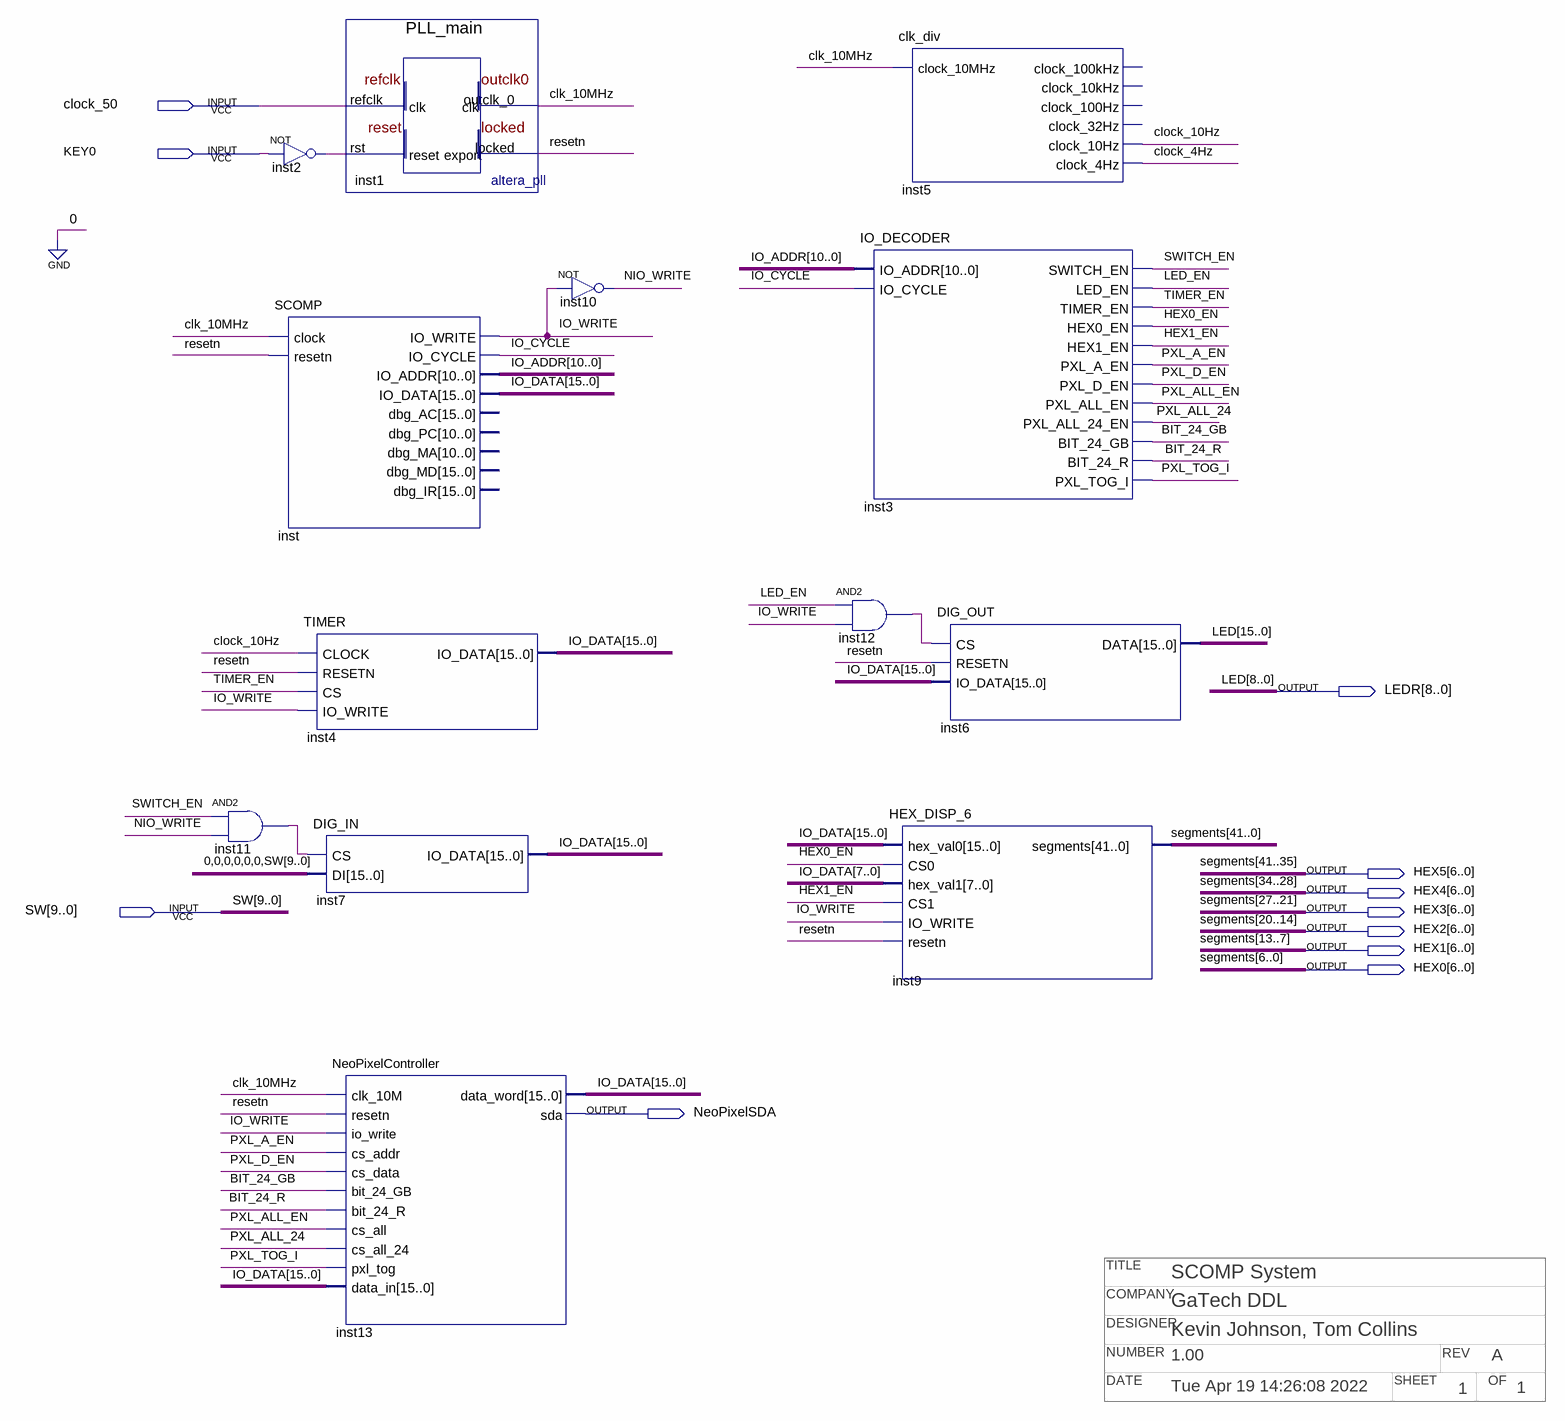
[diagram p0: schematic sheet]
// Quartus schematic SCOMP_System.bdf as structural Verilog: 13 symbols, 11 pins
// Title block: COMPANY: GaTech DDL; DATE: Tue Apr 19 14:26:08 2022; DESIGNER: Kevin Johnson, Tom Collins; NUMBER: 1.00; OF: 1; REV: A; SHEET: 1; TITLE: SCOMP System
module SCOMP_System (
  input  clock_50,
  input  KEY0,
  input  [9:0] SW,
  output [8:0] LEDR,
  output [6:0] HEX5,
  output [6:0] HEX4,
  output [6:0] HEX3,
  output [6:0] HEX2,
  output [6:0] HEX1,
  output [6:0] HEX0,
  output NeoPixelSDA
);

  wire BIT_24_GB, BIT_24_R, clk_10MHz, clock_4Hz, clock_10Hz, HEX0_EN, HEX1_EN, inst2_out, inst11_out,
       inst12_out, IO_CYCLE, IO_WRITE, LED_EN, NIO_WRITE, PXL_A_EN, PXL_ALL_24, PXL_ALL_EN, PXL_D_EN,
       PXL_TOG_I, resetn, SWITCH_EN, TIMER_EN;
  wire [10:0] IO_ADDR;
  wire [15:0] IO_DATA;
  wire [15:9] LED;

  and inst11 (inst11_out, SWITCH_EN, NIO_WRITE);
  not inst2 (inst2_out, KEY0);
  SCOMP inst (
    .clock(clk_10MHz), .resetn(resetn), .IO_WRITE(IO_WRITE), .IO_CYCLE(IO_CYCLE), .IO_ADDR(IO_ADDR),
    .IO_DATA(IO_DATA));  // open: dbg_AC, dbg_PC, dbg_MA, dbg_MD, dbg_IR
  TIMER inst4 (.CLOCK(clock_10Hz), .RESETN(resetn), .CS(TIMER_EN), .IO_WRITE(IO_WRITE), .IO_DATA(IO_DATA));
  DIG_IN inst7 (.CS(inst11_out), .DI({{6{1'b0}}, SW}), .IO_DATA(IO_DATA));
  PLL_main inst1 (.refclk(clock_50), .rst(inst2_out), .outclk_0(clk_10MHz), .locked(resetn));
  NeoPixelController inst13 (
    .clk_10M(clk_10MHz), .resetn(resetn), .io_write(IO_WRITE), .cs_addr(PXL_A_EN), .cs_data(PXL_D_EN),
    .bit_24_GB(BIT_24_GB), .bit_24_R(BIT_24_R), .cs_all(PXL_ALL_EN), .cs_all_24(PXL_ALL_24),
    .pxl_tog(PXL_TOG_I), .data_in(IO_DATA), .data_word(IO_DATA), .sda(NeoPixelSDA));
  not inst10 (NIO_WRITE, IO_WRITE);
  and inst12 (inst12_out, LED_EN, IO_WRITE);
  clk_div inst5 (
    .clock_10MHz(clk_10MHz), .clock_10Hz(clock_10Hz), .clock_4Hz(clock_4Hz));  // open: clock_100kHz, clock_10kHz, clock_100Hz, clock_32Hz
  IO_DECODER inst3 (
    .IO_ADDR(IO_ADDR), .IO_CYCLE(IO_CYCLE), .SWITCH_EN(SWITCH_EN), .LED_EN(LED_EN), .TIMER_EN(TIMER_EN),
    .HEX0_EN(HEX0_EN), .HEX1_EN(HEX1_EN), .PXL_A_EN(PXL_A_EN), .PXL_D_EN(PXL_D_EN), .PXL_ALL_EN(PXL_ALL_EN),
    .PXL_ALL_24_EN(PXL_ALL_24), .BIT_24_GB(BIT_24_GB), .BIT_24_R(BIT_24_R), .PXL_TOG_I(PXL_TOG_I));
  HEX_DISP_6 inst9 (
    .hex_val0(IO_DATA), .CS0(HEX0_EN), .hex_val1(IO_DATA[7:0]), .CS1(HEX1_EN), .IO_WRITE(IO_WRITE),
    .resetn(resetn), .segments({HEX5, HEX4, HEX3, HEX2, HEX1, HEX0}));
  DIG_OUT inst6 (.CS(inst12_out), .RESETN(resetn), .IO_DATA(IO_DATA), .DATA({LED, LEDR}));

  // Other names for the same wires on the sheet: LED[8:0] = LEDR;
  //   segments[41:0] = {HEX5, HEX4, HEX3, HEX2, HEX1, HEX0}
endmodule
